# EAGLE design board (EAGLE 9.4.2)
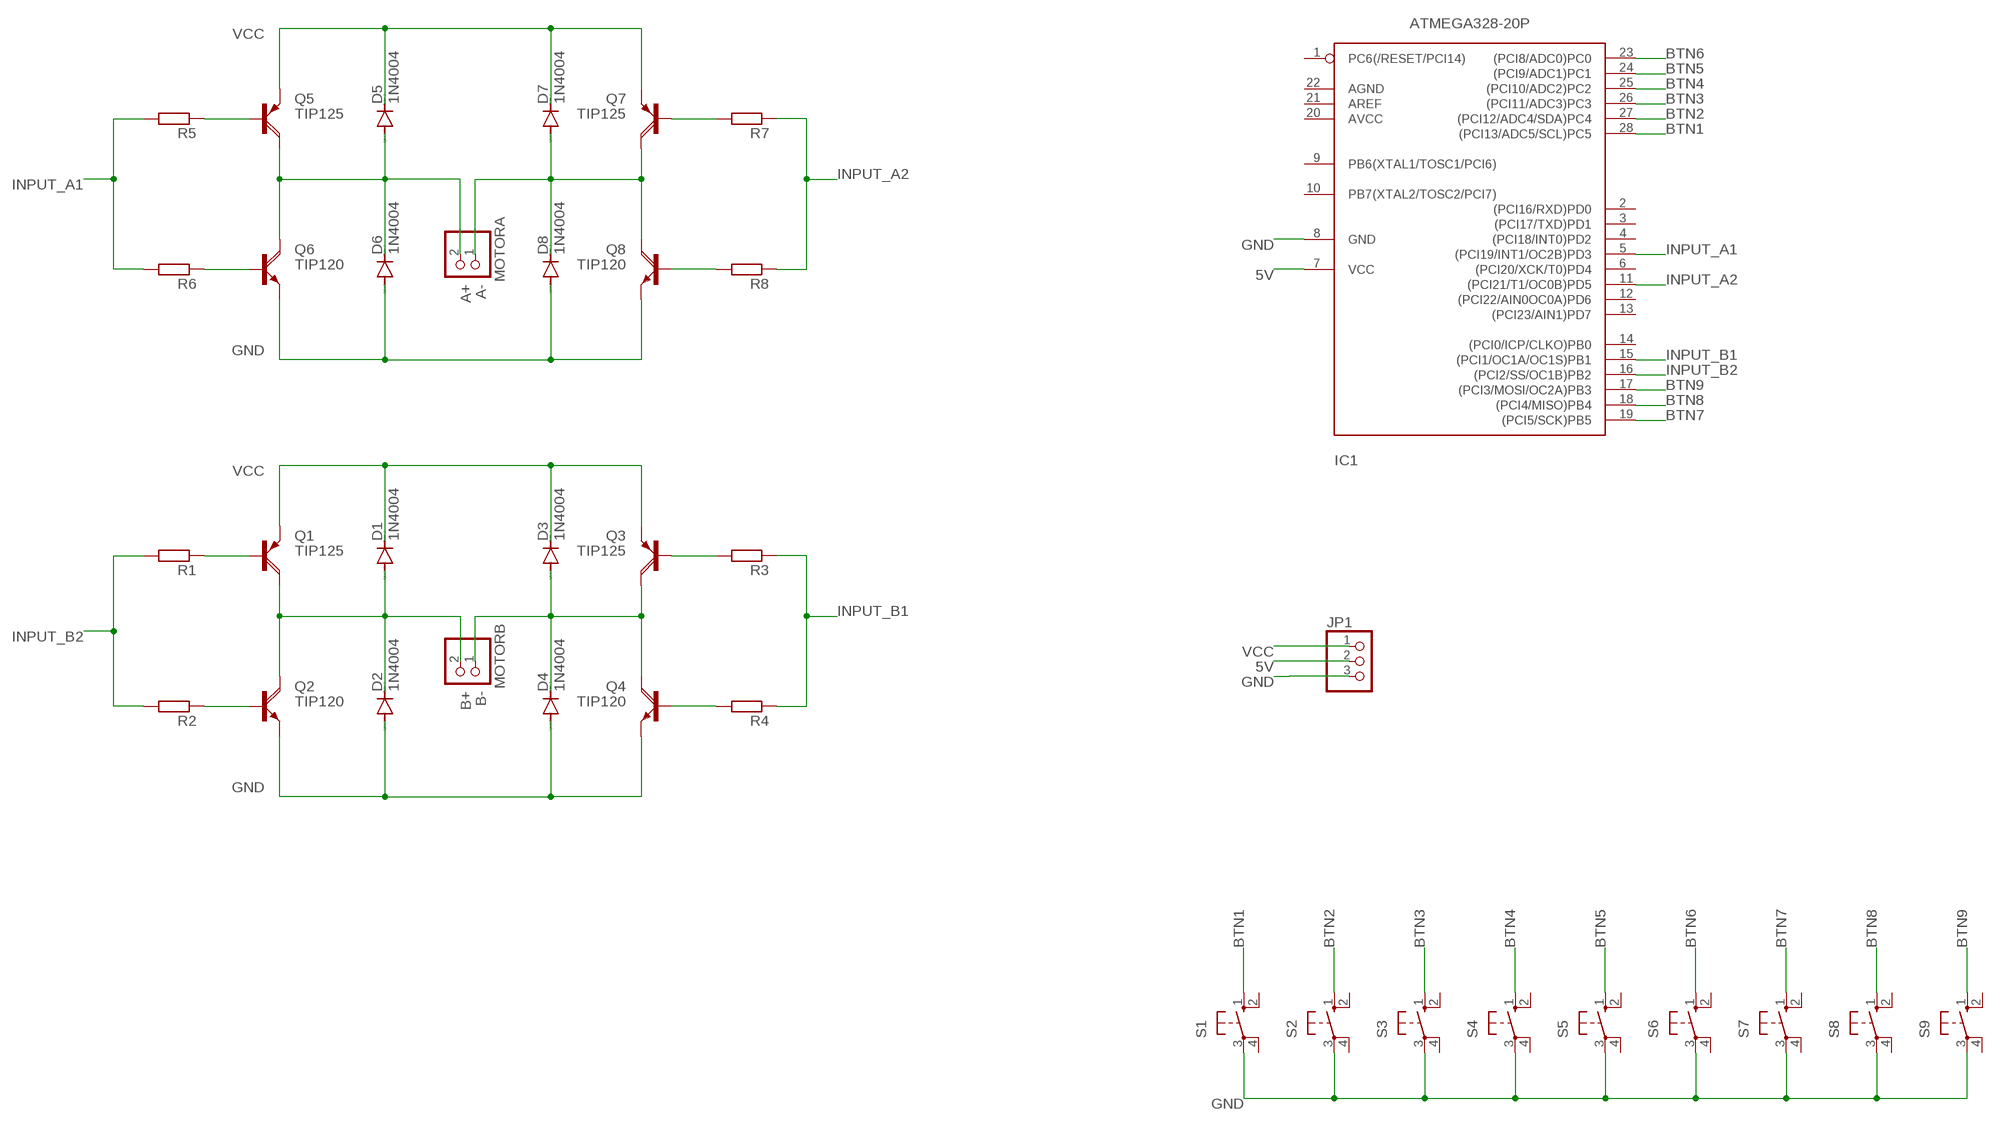
[diagram p0: schematic, sheet 1]

## Parts
D1  1N4004  [DO41-10]
D2  1N4004  [DO41-10]
D3  1N4004  [DO41-10]
D4  1N4004  [DO41-10]
D5  1N4004  [DO41-10]
D6  1N4004  [DO41-10]
D7  1N4004  [DO41-10]
D8  1N4004  [DO41-10]
IC1  ATMEGA328-20P  [DIL28-3]
JP1  PINHD-1X3  [1X03]
MOTORA  PINHD-1X2  [1X02]
MOTORB  PINHD-1X2  [1X02]
Q1  TIP125  [TO220AH]
Q2  TIP120  [TO220AH]
Q3  TIP125  [TO220AH]
Q4  TIP120  [TO220AH]
Q5  TIP125  [TO220AH]
Q6  TIP120  [TO220AH]
Q7  TIP125  [TO220AH]
Q8  TIP120  [TO220AH]
R1  R-EU_0204/7  [0204/7]
R2  R-EU_0204/7  [0204/7]
R3  R-EU_0204/7  [0204/7]
R4  R-EU_0204/7  [0204/7]
R5  R-EU_0204/7  [0204/7]
R6  R-EU_0204/7  [0204/7]
R7  R-EU_0204/7  [0204/7]
R8  R-EU_0204/7  [0204/7]
S1  10-XX  [B3F-10XX]
S2  10-XX  [B3F-10XX]
S3  10-XX  [B3F-10XX]
S4  10-XX  [B3F-10XX]
S5  10-XX  [B3F-10XX]
S6  10-XX  [B3F-10XX]
S7  10-XX  [B3F-10XX]
S8  10-XX  [B3F-10XX]
S9  10-XX  [B3F-10XX]

## Nets
5V: IC1.7(VCC) JP1.2
A+: D5.A D6.C MOTORA.2 Q5.C Q6.C
A-: D7.A D8.C MOTORA.1 Q7.C Q8.C
B+: D1.A D2.C MOTORB.2 Q1.C Q2.C
B-: D3.A D4.C MOTORB.1 Q3.C Q4.C
BTN1: IC1.28((PCI13/ADC5/SCL)PC5) S1.1(S)
BTN2: IC1.27((PCI12/ADC4/SDA)PC4) S2.1(S)
BTN3: IC1.26((PCI11/ADC3)PC3) S3.1(S)
BTN4: IC1.25((PCI10/ADC2)PC2) S4.1(S)
BTN5: IC1.24((PCI9/ADC1)PC1) S5.1(S)
BTN6: IC1.23((PCI8/ADC0)PC0) S6.1(S)
BTN7: IC1.19((PCI5/SCK)PB5) S7.1(S)
BTN8: IC1.18((PCI4/MISO)PB4) S8.1(S)
BTN9: IC1.17((PCI3/MOSI/OC2A)PB3) S9.1(S)
GND: D2.A D4.A D6.A D8.A IC1.8(GND) JP1.3 Q2.E Q4.E Q6.E Q8.E S1.3(P) S2.3(P) S3.3(P) S4.3(P) S5.3(P) S6.3(P) S7.3(P) S8.3(P) S9.3(P)
INPUT_A1: IC1.5((PCI19/INT1/OC2B)PD3) R5.2 R6.2
INPUT_A2: IC1.11((PCI21/T1/OC0B)PD5) R7.1 R8.1
INPUT_B1: IC1.15((PCI1/OC1A/OC1S)PB1) R3.1 R4.1
INPUT_B2: IC1.16((PCI2/SS/OC1B)PB2) R1.2 R2.2
N$1: Q2.B R2.1
N$2: Q1.B R1.1
N$8: Q6.B R6.1
N$10: Q3.B R3.2
N$11: Q4.B R4.2
N$12: Q5.B R5.1
N$18: Q7.B R7.2
N$19: Q8.B R8.2
VCC: D1.C D3.C D5.C D7.C JP1.1 Q1.E Q3.E Q5.E Q7.E
Unconnected: IC1.1(PC6(/RESET/PCI14)) IC1.2((PCI16/RXD)PD0) IC1.3((PCI17/TXD)PD1) IC1.4((PCI18/INT0)PD2) IC1.6((PCI20/XCK/T0)PD4) IC1.9(PB6(XTAL1/TOSC1/PCI6)) IC1.10(PB7(XTAL2/TOSC2/PCI7)) IC1.12((PCI22/AIN0OC0A)PD6) IC1.13((PCI23/AIN1)PD7) IC1.14((PCI0/ICP/CLKO)PB0) IC1.20(AVCC) IC1.21(AREF) IC1.22(AGND) S1.2(S1) S1.4(P1) S2.2(S1) S2.4(P1) S3.2(S1) S3.4(P1) S4.2(S1) S4.4(P1) S5.2(S1) S5.4(P1) S6.2(S1) S6.4(P1) S7.2(S1) S7.4(P1) S8.2(S1) S8.4(P1) S9.2(S1) S9.4(P1)

## Library data of the parts
D1-D8 = diode:1N4004: DIODE general purpose rectifier, 1 A
IC1 = atmega328:ATMEGA328*P: MICROCONTROLLER 32 kBytes FLASH 2 kBytes SRAM 1 kBytes EEPROM USART 8-channel 10 bit ADC
JP1 = pinhead:PINHD-1X3: PIN HEADER
MOTORA MOTORB = pinhead:PINHD-1X2: PIN HEADER
Q1 Q3 Q5 Q7 = transistor-power:TIP125: PNP DARLINGTON TRANSISTOR
Q2 Q4 Q6 Q8 = transistor-power:TIP120: NPN DARLINGTON TRANSISTOR
R1-R8 = rcl:R-EU_: RESISTOR, European symbol; SPICEPREFIX: R
S1-S9 = switch-omron:10-XX: OMRON SWITCH; MPN: B3F-1000; OC_FARNELL: 176432; OC_NEWARK: 36M3542

## Board
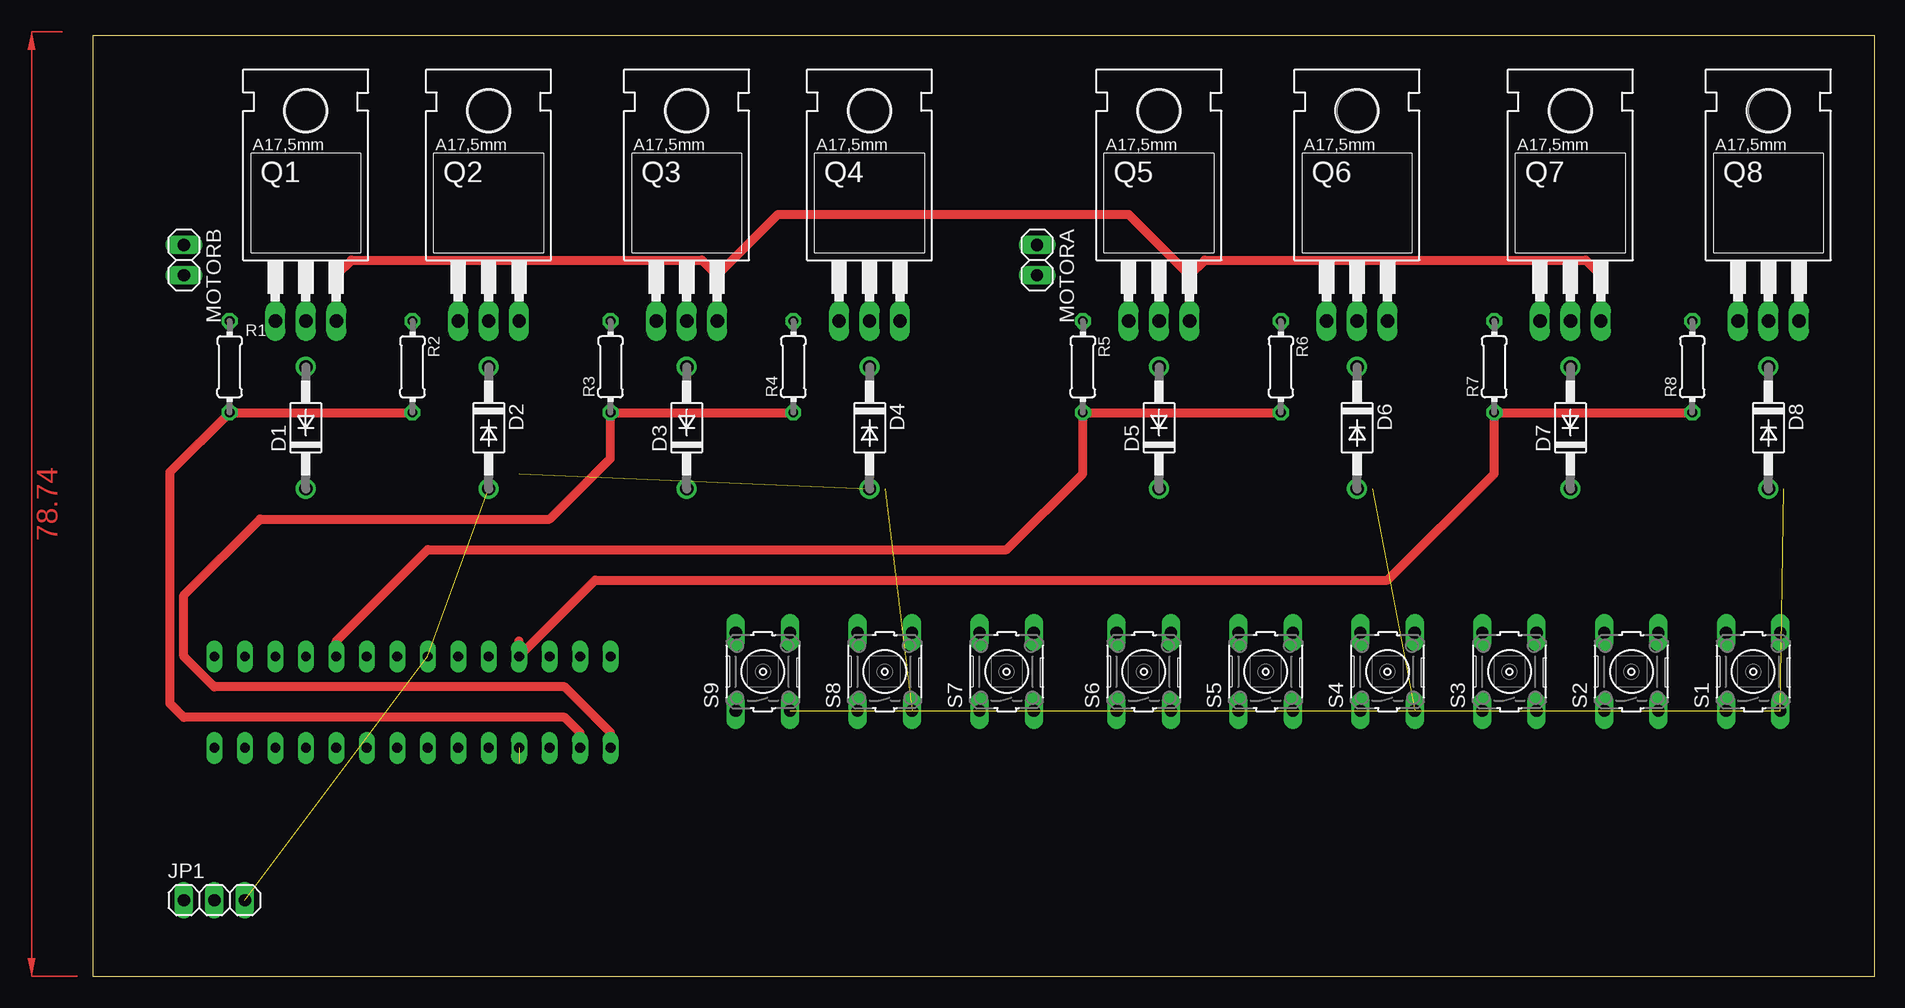
[diagram p1: board, top side]
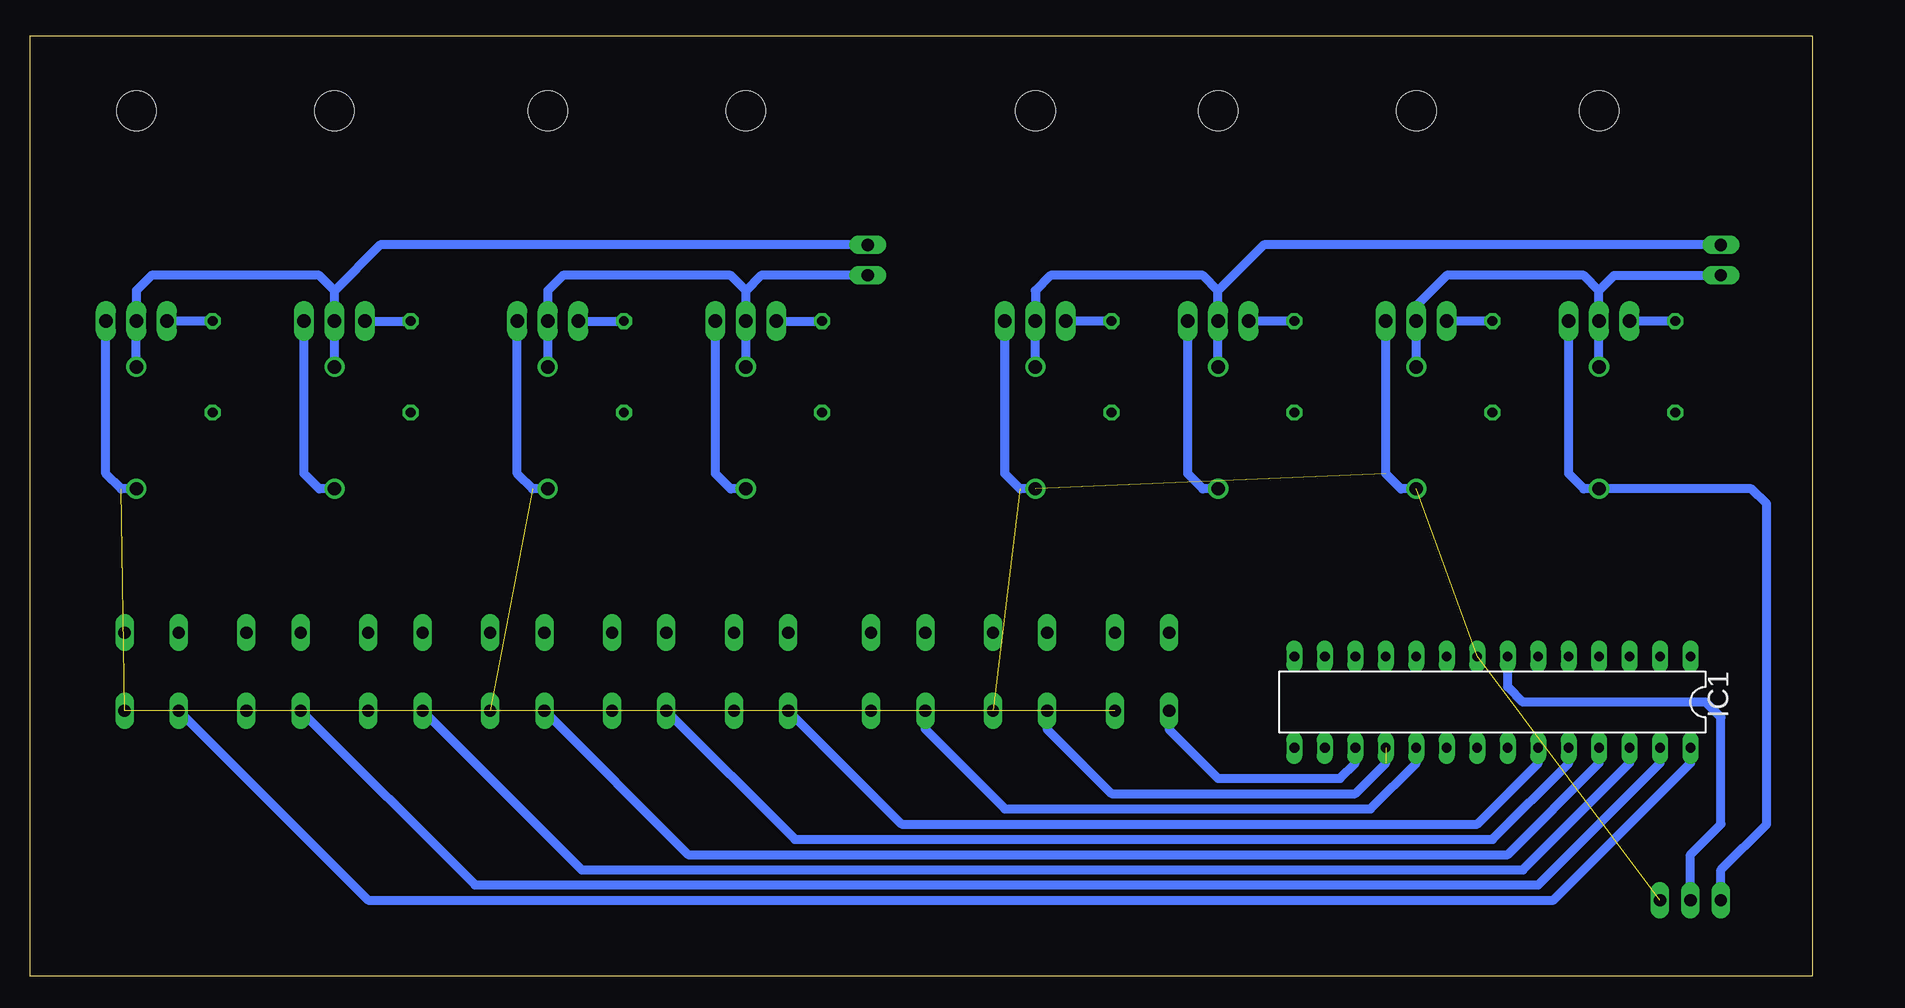
[diagram p2: board, bottom side, seen from below]

Size 148.57 x 78.41 mm. Coordinates in mm from the lower left corner, seen from the top.
Outline: 0,0 148.57,0 148.57,78.41 0,78.41 0,0
Copper layers (1*16): Top 0.035mm / dielectric 1.5mm / Bottom 0.035mm
Design rules "default": minimum track width 6mil, minimum drill 0.35mm, track to track 6mil, track to pad 6mil, pad to pad 6mil, via to via 6mil, smd to smd 6mil, copper to edge 40mil, drill to drill 6mil, minimum pad ring 10mil, minimum via ring 8mil, stop-mask expansion 4mil, vias tented up to drill 0mil, thermal gap 10mil

### Footprints (pad centres in the part's own frame; a part is rotated, then mirrored left to right if it is on the bottom)
DO41-10 = drill 1.118: A 5.08,0; C -5.08,0
DIL28-3 = drill 0.813 long: 1 -16.51,-3.81; 2 -13.97,-3.81; 3 -11.43,-3.81; 4 -8.89,-3.81; 5 -6.35,-3.81; 6 -3.81,-3.81; 7 -1.27,-3.81; 8 1.27,-3.81; 9 3.81,-3.81; 10 6.35,-3.81; 11 8.89,-3.81; 12 11.43,-3.81; 13 13.97,-3.81; 14 16.51,-3.81; 15 16.51,3.81; 16 13.97,3.81; 17 11.43,3.81; 18 8.89,3.81; 19 6.35,3.81; 20 3.81,3.81; 21 1.27,3.81; 22 -1.27,3.81; 23 -3.81,3.81; 24 -6.35,3.81; 25 -8.89,3.81; 26 -11.43,3.81; 27 -13.97,3.81; 28 -16.51,3.81
1X03 = drill 1.016 long: 1 -2.54,0; 2 0,0; 3 2.54,0
1X02 = drill 1.016 long: 1 -1.27,0; 2 1.27,0
TO220AH = drill 1.118 long: B -2.54,-6.35; C 0,-6.35; E 2.54,-6.35 | hole 3.302: 0,11.176
0204/7 = drill 0.813 octagon: 1 -3.81,0; 2 3.81,0
B3F-10XX = drill 1.016 long: 1 -3.251,2.261; 2 3.251,2.261; 3 -3.251,-2.261; 4 3.251,-2.261

### Placement (x,y rotation side)
D1  17.78,45.72 90 top
D2  33.02,45.72 270 top
D3  49.53,45.72 90 top
D4  64.77,45.72 270 top
D5  88.9,45.72 90 top
D6  105.41,45.72 270 top
D7  123.19,45.72 90 top
D8  139.7,45.72 270 top
IC1  26.67,22.86 180 bottom
JP1  10.16,6.35 0 top
MOTORA  78.74,59.69 270 top
MOTORB  7.62,59.69 270 top
Q1  17.78,60.96 0 top
Q2  33.02,60.96 0 top
Q3  49.53,60.96 0 top
Q4  64.77,60.96 0 top
Q5  88.9,60.96 0 top
Q6  105.41,60.96 0 top
Q7  123.19,60.96 0 top
Q8  139.7,60.96 0 top
R1  11.43,50.8 270 top
R2  26.67,50.8 270 top
R3  43.18,50.8 90 top
R4  58.42,50.8 90 top
R5  82.55,50.8 270 top
R6  99.06,50.8 270 top
R7  116.84,50.8 90 top
R8  133.35,50.8 90 top
S1  138.43,25.4 90 top
S2  128.27,25.4 90 top
S3  118.11,25.4 90 top
S4  107.95,25.4 90 top
S5  97.79,25.4 90 top
S6  87.63,25.4 90 top
S7  76.2,25.4 90 top
S8  66.04,25.4 90 top
S9  55.88,25.4 90 top

### Tracks (layer width: path | path; a pad name or v marks a point on that pad's centre or on a via)
5V
  Bottom 0.762: JP1.2 10.16,10.16 7.62,12.7 7.62,21.59 8.89,22.86 24.13,22.86 25.4,24.13 IC1.7
A+
  Bottom 0.762: D5.A Q5.C 88.9,57.15 | D6.C Q6.C 105.41,57.15 104.14,58.42 90.17,58.42 88.9,57.15 | MOTORA.2 87.63,58.42 88.9,57.15
A-
  Bottom 0.762: D7.A Q7.C 123.19,57.15 | D8.C Q8.C 139.7,57.15 138.43,58.42 124.46,58.42 123.19,57.15 | MOTORA.1 119.38,60.96 123.19,57.15
B+
  Bottom 0.762: D1.A Q1.C 17.78,57.15 | D2.C Q2.C 33.02,55.88 30.48,58.42 19.05,58.42 17.78,57.15 | 17.78,57.15 16.51,58.42 MOTORB.2
B-
  Bottom 0.762: D3.A Q3.C 49.53,57.15 | D4.C Q4.C 64.77,57.15 63.5,58.42 50.8,58.42 49.53,57.15 | MOTORB.1 45.72,60.96 49.53,57.15
BTN1
  Bottom 0.762: S1.1 120.37,6.35 21.59,6.35 10.16,17.78 IC1.28
BTN2
  Bottom 0.762: S2.1 111.48,7.62 22.86,7.62 12.7,17.78 IC1.27
BTN3
  Bottom 0.762: S3.1 102.59,8.89 24.13,8.89 15.24,17.78 IC1.26
BTN4
  Bottom 0.762: S4.1 93.7,10.16 25.4,10.16 17.78,17.78 IC1.25
BTN5
  Bottom 0.762: S5.1 84.81,11.43 26.67,11.43 20.32,17.78 IC1.24
BTN6
  Bottom 0.762: S6.1 75.92,12.7 27.94,12.7 22.86,17.78 IC1.23
BTN7
  Bottom 0.762: S7.1 73.94,20.6 67.31,13.97 36.83,13.97 33.02,17.78 IC1.19
BTN8  (1 unrouted)
  Bottom 0.762: S8.1 63.78,20.6 58.42,15.24 38.1,15.24 35.56,17.78
BTN9
  Bottom 0.762: S9.1 53.62,20.6 49.53,16.51 39.37,16.51 38.1,17.78 IC1.17
GND  (14 unrouted)
  Bottom 0.762: D2.A 34.29,40.64 35.56,41.91 Q2.E | D4.A 66.04,40.64 67.31,41.91 Q4.E | D6.A 106.68,40.64 107.95,41.91 Q6.E | D8.A 140.97,40.64 142.24,41.91 Q8.E
INPUT_A1
  Top 0.762: R6.2 R5.2 82.55,41.91 76.2,35.56 27.94,35.56 20.32,27.94 IC1.5
INPUT_A2
  Top 0.762: R8.1 R7.1 116.84,41.91 107.95,33.02 41.91,33.02 IC1.11 35.56,27.94
INPUT_B1
  Top 0.762: R4.1 R3.1 43.18,43.18 38.1,38.1 13.97,38.1 7.62,31.75 7.62,26.67 10.16,24.13 39.37,24.13 43.18,20.32 IC1.15
INPUT_B2
  Top 0.762: R2.2 R1.2 6.48,42.04 6.48,22.73 7.62,21.59 39.37,21.59 40.64,20.32 IC1.16
N$1
  Bottom 0.762: R2.1 Q2.B
N$2
  Bottom 0.762: R1.1 Q1.B
N$8
  Bottom 0.762: Q6.B R6.1
N$10
  Bottom 0.762: R3.2 Q3.B
N$11
  Bottom 0.762: R4.2 Q4.B
N$12
  Bottom 0.762: Q5.B R5.1
N$18
  Bottom 0.762: Q7.B R7.2
N$19
  Bottom 0.762: R8.2 Q8.B
VCC
  Top 0.762: 52.07,58.42 50.8,59.69 21.59,59.69 20.32,58.42 Q1.E | Q5.E 91.44,58.42 | 91.44,58.42 92.71,59.69 124.46,59.69 125.73,58.42 Q7.E | Q3.E 52.07,58.42 | 52.07,58.42 57.15,63.5 86.36,63.5 91.44,58.42
  Bottom 0.762: Q1.E 20.32,41.91 19.05,40.64 D1.C 5.08,40.64 3.81,39.37 3.81,12.7 7.62,8.89 JP1.1 | D3.C 50.8,40.64 52.07,41.91 Q3.E | D5.C 90.17,40.64 91.44,41.91 Q5.E | D7.C 124.46,40.64 125.73,41.91 Q7.E
(copper drawn outside any net)
  shapes: Top area x1